# Altium schematic sheet ProjectSchematic.SchDoc
size A
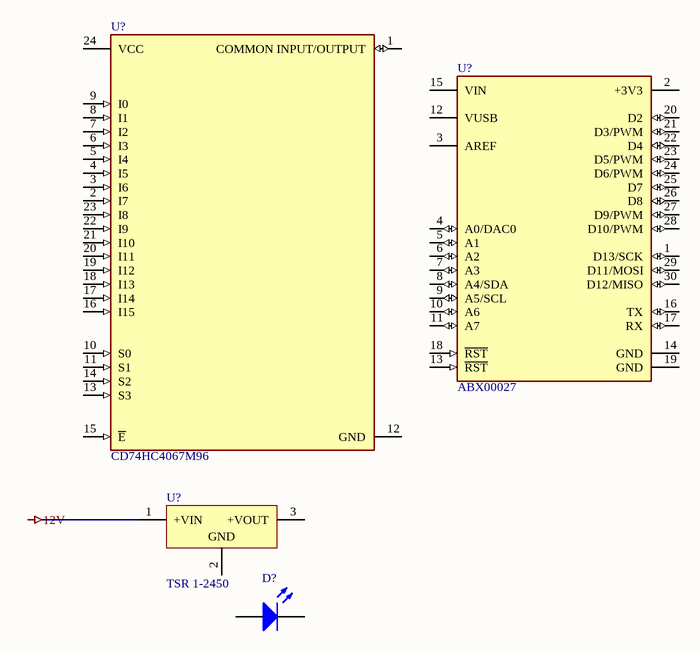
[diagram p0: ProjectSchematic.SchDoc]

## Parts
(Parts that share a designator on the sheet are numbered #1, #2 ... from top to bottom, then left to right.)
D?  Light-Emitting Diode  (value not drawn)
U?#1  CD74HC4067M96  [FP-DW0024A-MFG]
U?#2  ABX00027  [FP-ABX00027-MFG]
U?#3  TSR 1-2450  [TRACO-SIP-3_V]

## Nets

Not connected (* = marked no-connect by the designer): D? 1(A) 2(K); U?#1 1(COMMON_INPUT/OUTPUT) 2(I7) 3(I6) 4(I5) 5(I4) 6(I3) 7(I2) 8(I1) 9(I0) 10(S0) 11(S1) 12(GND) 13(S3) 14(S2) 15(~{E}) 16(I15) 17(I14) 18(I13) 19(I12) 20(I11) 21(I10) 22(I9) 23(I8) 24(VCC); U?#2 1(D13/SCK) 2(+3V3) 3(AREF) 4(A0/DAC0) 5(A1) 6(A2) 7(A3) 8(A4/SDA) 9(A5/SCL) 10(A6) 11(A7) 12(VUSB) 13(~{RST}) 14(GND) 15(VIN) 16(TX) 17(RX) 18(~{RST}) 19(GND) 20(D2) 21(D3/PWM) 22(D4) 23(D5/PWM) 24(D6/PWM) 25(D7) 26(D8) 27(D9/PWM) 28(D10/PWM) 29(D11/MOSI) 30(D12/MISO); U?#3 1(+VIN) 2(GND) 3(+VOUT)

## Notes on the sheet
- Labels drawn without touching a wire or pin: 12V

## Library data of the parts
D? = LED: AF: 1; BV: 0; BV_MAX: 1e99; EG: 1.11; FC: 0.5; IBV: 0.001; IS: 1e-14; MJSW: 0.33; NTUN: 30; TNOM: 27; XTI: 3; SimulationGenericComponent: True; CJO: 0; CJP: 0; CTA: 0; CTP: 0; FCS: 0.5; FV_MAX: 1e99; IKF: 0; IKR: 0; ISR: 1e-14; JSW: 0; JTUN: 0; JTUNSW: 0; KEG: 1; KF: 0; LEVEL: 1; N: 1; NBV: 1; NR: 1; NS: 1; PHP: 1; RS: 0; TCV: 0; TLEV: 0; TLEVC: 0; TM1: 0; TM2: 0; TPB: 0; TPHP: 0; TRS: 0; TRS2: 0; TT: 0; TTT1: 0; TTT2: 0; VJ: 1; XTITUN: 3
U?#1 = CMP-04901-000007-1: IC MUX/DEMUX 1X16 24SOIC; Manufacturer: Texas Instruments; Standoff Height: 0.1mm; Logic Function Desc: Non-Inverting; Max Supply Voltage: 6V; Number Of Inputs: 16; Quiescent Current: 8uA; Number Of Circuits: 1; Propagation Delay: 6ns; Max Junction Temp: +150°C; Min Supply Voltage: 2V; ComponentLink2Description: Datasheet; Octopart: https://octopart.com/cd74hc4067m96-texas+instruments-722802; Ambient Temperature Range High: +125°C; Ipc Land Pattern Name: SOIC127P1030X265-24; Height: 2.65mm; Mouser Description: Multiplexer Switch ICs Hi-Spd CMOS 16Ch Anl Mltplxr/Demltplxr; Temperature Range Low: -55°C; Package: DW0024A; Temperature Range High: +125°C; Lead Free: Yes; ComponentLink2URL: http://www.ti.com/lit/ds/symlink/cd74hc4067.pdf; Manufacturer Part Number: CD74HC4067M96; RoHS: TRUE; Automotive: No; Device Class L1: Integrated Circuits (ICs); Digikey Description: IC MUX/DEMUX 1X16 24SOIC; Device Class L2: Logic ICs; Temperature: -55°C to +125°C; Device Class L3: Multiplexers; Category: IC; Ambient Temperature Range Low: -55°C; Number Of Outputs: 1
U?#2 = CMP-189990-000001-1: ARDUINO NANO 33 IOT; Number Of Usb Channels: 1; Memory Size: 256KBytes; Interface: I2C,SPI,UART,USB,Other; Number Of Timers/Counters: 5; Memory Type: FLASH; Frequency: 48MHz; Data Bus Width: 32bits; Number Of I/Os: 23; Min Supply Voltage: 4.5V; Core Architecture: ARM Cortex-M0+; Ram Size: 32KBytes; Number Of Adc Channels: 8; Max Supply Voltage: 21V; Manufacturer Part Number: ABX00027; RoHS: TRUE; Automotive: No; Footprint Url: https://content.arduino.cc/assets/Nano33IoT.zip; Number Of A/D Converters: 1; Device Class L3: Microcontrollers; Manufacturer: Arduino; Number Of Spi Channels: 1; Ipc Land Pattern Name: DFN4400X1778X80-30; Category: IC; Number Of Cores: 1; Package: 0; ComponentLink2URL: https://store.arduino.cc/arduino-nano-33-iot; ComponentLink2Description: Datasheet; Digikey Description: ARDUINO NANO 33 IOT; Number Of Uart Channels: 1; Lead Free: Yes; Address Bus Width: 32bits; Device Class L2: Embedded Processors and Controllers; Octopart: https://octopart.com/abx00027-arduino-102769437; Number Of Pwm Channels: 5; Number Of I2C Channels: 1; Device Class L1: Integrated Circuits (ICs)
U?#3 = CMP-2000-05427-1: DC/DC converter, 5 VDC, 1000 mA, -40 to 85 degC, 3-Pin SIP, RoHS; Manufacturer: Tracopower; Output Voltage Nom.: 5V; Output Current Max: 1A; Product Range: TSR-1Series; DC / DC Converter Mounting: ThroughHole; Output Power Max: 5W; No. of Outputs: 1Output; Input Voltage DC Max: 36V; Approvals & Standards: IEC,UL; Input Voltage DC Min: 6.5V; DC / DC Converter Output Type: Fixed; Depth: 11.7mm; Package Reference: SIP-3; DC / DC Converter Type: SIP; Height: 10.2mm; Width: 7.6mm; Package Description: 3-Pin Single In-line Package, Body 11.7 x 7.6 mm, Pitch 2.54 mm; Manufacturer URL: http://www.tracopower.com/home; Datasheet Version: Jan-15; Datasheet URL: https://datasheet.ciiva.com/6815/tsr1-6815641.pdf